# Altium schematic sheet Coil Board - Planar_Coils.SchDoc: Planar Coil Row
size B
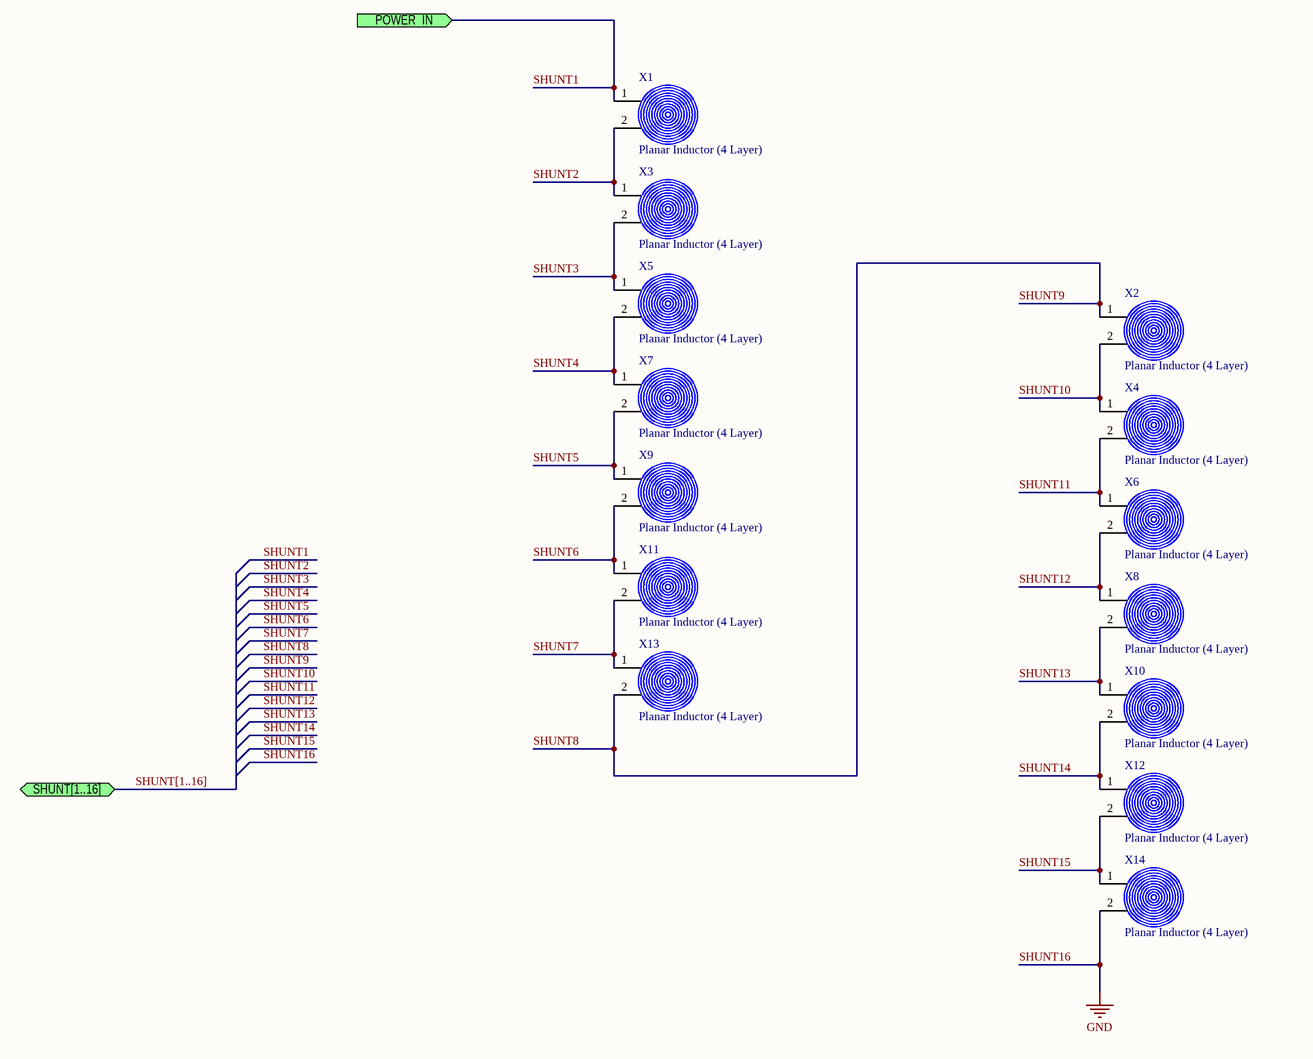
[diagram p0: Coil Board - Planar_Coils.SchDoc]

## Parts
X1  Planar Inductor (4 Layer)  [Planar Coil - 44 Turns (12.5mm)]  (no BOM)
X2  Planar Inductor (4 Layer)  [Planar Coil - 44 Turns (12.5mm)]  (no BOM)
X3  Planar Inductor (4 Layer)  [Planar Coil - 44 Turns (12.5mm)]  (no BOM)
X4  Planar Inductor (4 Layer)  [Planar Coil - 44 Turns (12.5mm)]  (no BOM)
X5  Planar Inductor (4 Layer)  [Planar Coil - 44 Turns (12.5mm)]  (no BOM)
X6  Planar Inductor (4 Layer)  [Planar Coil - 44 Turns (12.5mm)]  (no BOM)
X7  Planar Inductor (4 Layer)  [Planar Coil - 44 Turns (12.5mm)]  (no BOM)
X8  Planar Inductor (4 Layer)  [Planar Coil - 44 Turns (12.5mm)]  (no BOM)
X9  Planar Inductor (4 Layer)  [Planar Coil - 44 Turns (12.5mm)]  (no BOM)
X10  Planar Inductor (4 Layer)  [Planar Coil - 44 Turns (12.5mm)]  (no BOM)
X11  Planar Inductor (4 Layer)  [Planar Coil - 44 Turns (12.5mm)]  (no BOM)
X12  Planar Inductor (4 Layer)  [Planar Coil - 44 Turns (12.5mm)]  (no BOM)
X13  Planar Inductor (4 Layer)  [Planar Coil - 44 Turns (12.5mm)]  (no BOM)
X14  Planar Inductor (4 Layer)  [Planar Coil - 44 Turns (12.5mm)]  (no BOM)

## Ports
POWER_IN (in), SHUNT[1..16] (bidir)

## Nets
SHUNT16: X14.2  [also labelled GND]
SHUNT1: X1.1 ; port POWER_IN
SHUNT2: X1.2 X3.1
SHUNT3: X3.2 X5.1
SHUNT4: X5.2 X7.1
SHUNT5: X7.2 X9.1
SHUNT6: X9.2 X11.1
SHUNT7: X11.2 X13.1
SHUNT8: X2.1 X13.2  [also labelled SHUNT9]
SHUNT10: X2.2 X4.1
SHUNT11: X4.2 X6.1
SHUNT12: X6.2 X8.1
SHUNT13: X8.2 X10.1
SHUNT14: X10.2 X12.1
SHUNT15: X12.2 X14.1

## Buses and harness runs
bus SHUNT[1..16] = port SHUNT[1..16]

## Notes on the sheet
- Title
- Size:
- Date:
- B
- Number:
- Time:
- Revision:
- Sheet
- of
- File:

## Library data of the parts
X1-X14 = Planar Coil - 44 Turns, 12mm: Resistance: 1.11ohm; Inductance: 2.44uH; Layers: 4